# Altium project PERfECT-PRO.PrjPcb
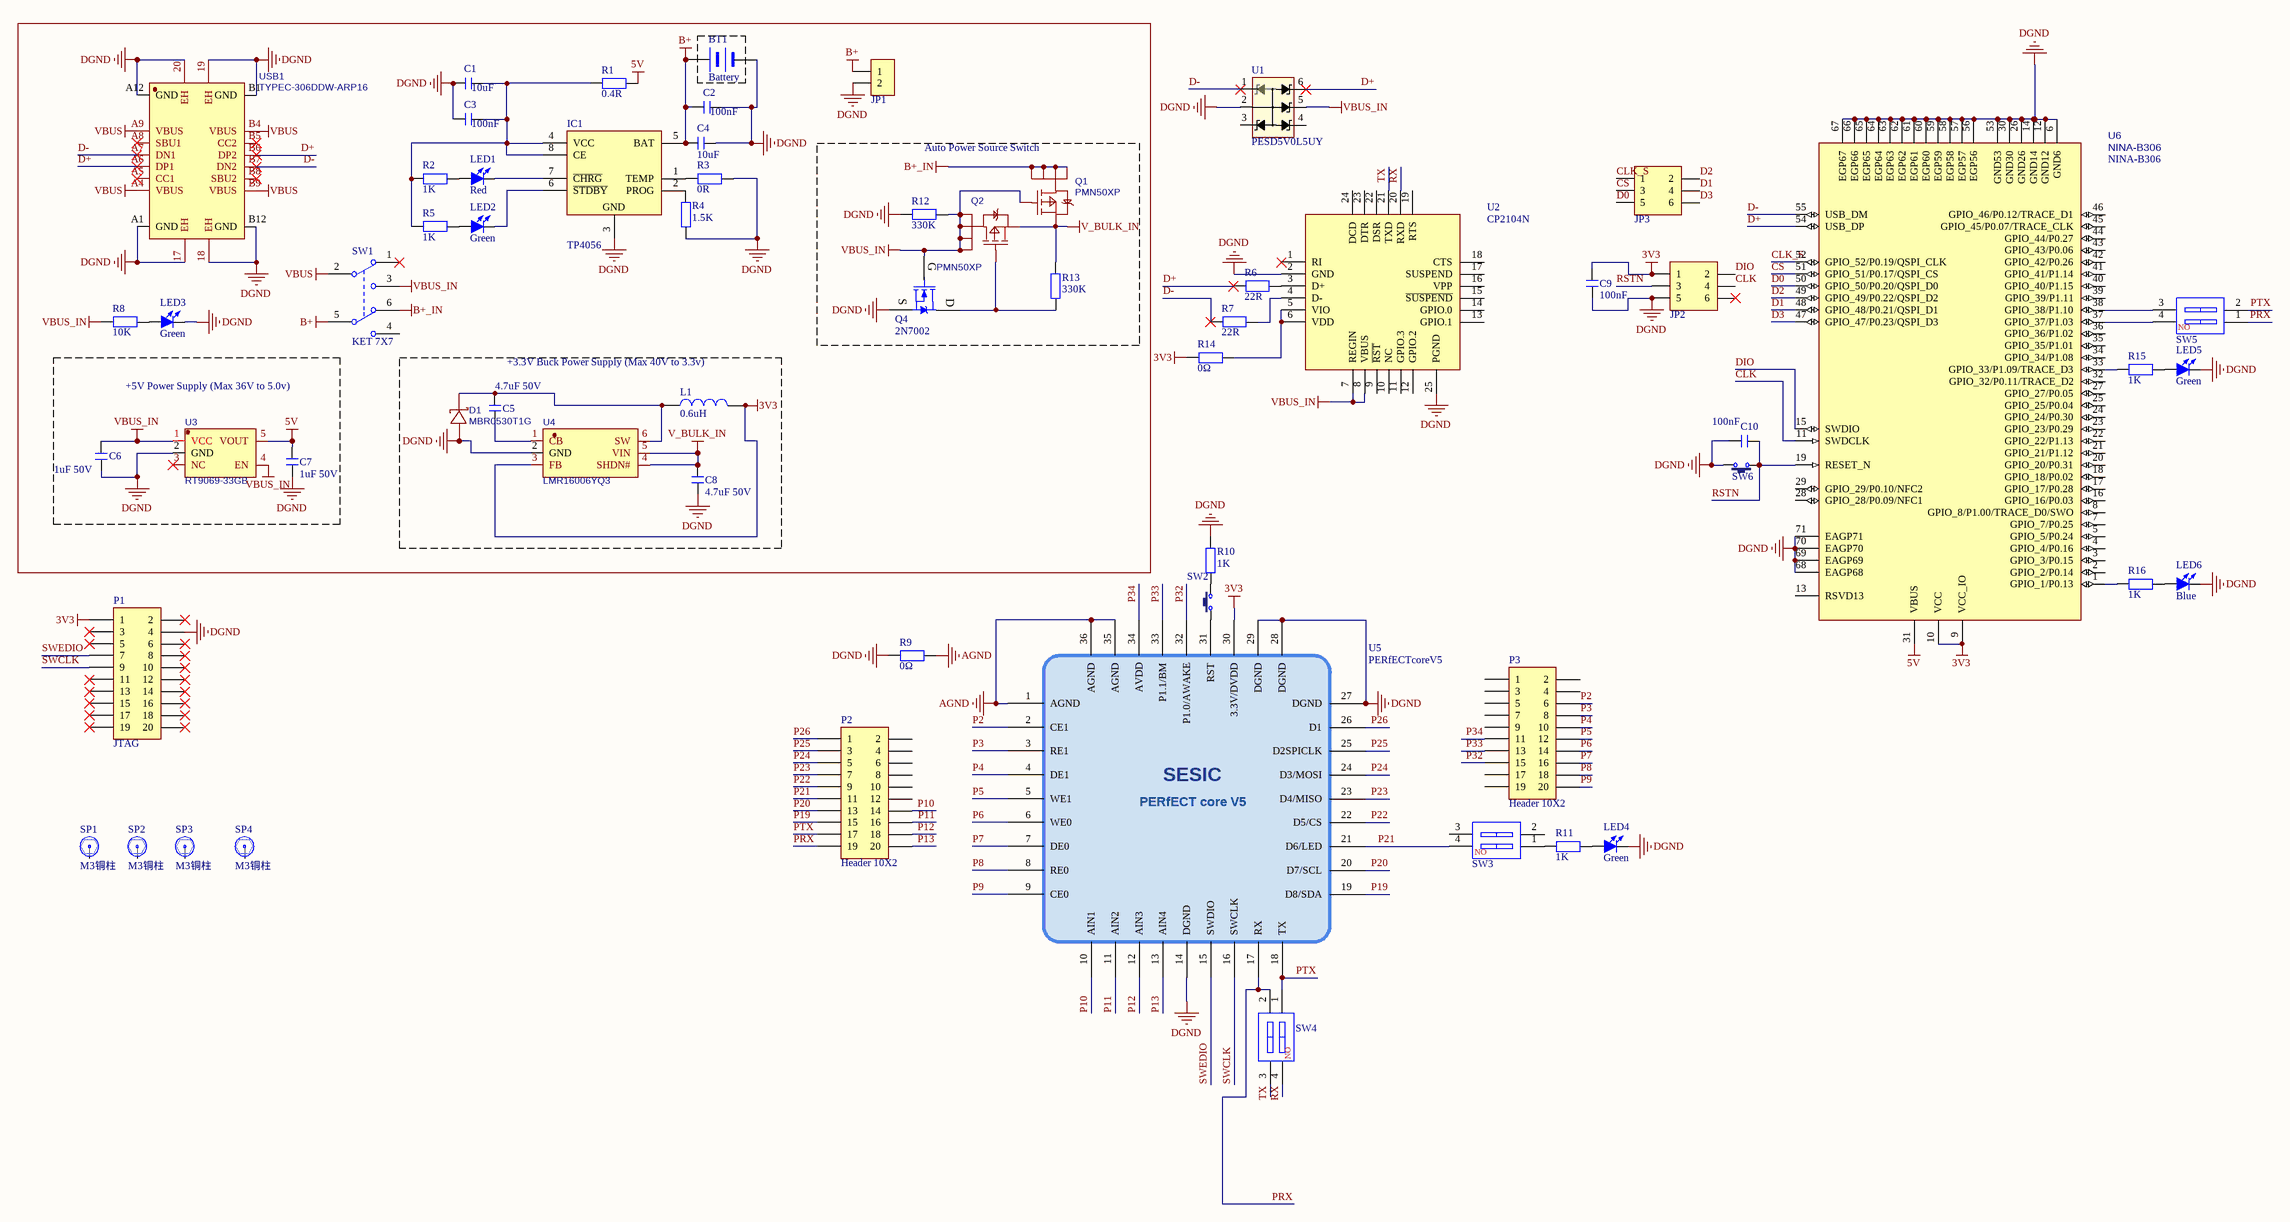
[diagram p0: PERfECT-PRO-1.SchDoc]
1 sheet, 62 parts. Net scope: global (net labels, ports and power ports of the same name join across sheets).
Board file: PERfECT-PRO.PcbDoc

## Sheet PERfECT-PRO-1.SchDoc
size A0

### Parts
BT1  Battery
C1  10uF  [C 0603_L]
C2  100nF  [C 0603_L]
C3  100nF  [C 0603_L]
C4  10uF  [C 0603_L]
C5  4.7uF 50V  [C 0603_L]
C6  1uF 50V  [C 0603_L]
C7  1uF 50V  [C 0603_L]
C8  4.7uF 50V  [C 0603_L]
C9  100nF  [C 0603_L]
C10  100nF  [C 0603_L]
D1  MBR0530T1G  [MBR0530T1G]
IC1  TP4056  [SOP8_N]
JP1  HDR-1X2  [XH2.54-LI-2P]  (value not drawn)
JP2  Header3X2  [HDR2.54-LI-2x3P]  (value not drawn)
JP3  Header3X2  [HDR2.54-LI-2x3P]  (value not drawn)
L1  0.6uH  [L 1206]
LED1  Red  [LED 0603R]
LED2  Green  [LED 0603R]
LED3  Green  [LED 0603R]
LED4  Green  [LED 0603R]
LED5  Green  [LED 0603R]
LED6  Blue  [LED 0603R]
P1  JTAG  [HDR2X10]
P2  Header 10X2  [HDR2X10]
P3  Header 10X2  [HDR2X10]
Q1  PMN50XP  [PMN50XP]
Q2  PMN50XP  [PMN50XP]
Q4  2N7002  [SOT23-3N]
R1  0.4R  [R 0603_L]
R2  1K  [R 0603_L]
R3  0R  [R 0603_L]
R4  1.5K  [R 0603_L]
R5  1K  [R 0603_L]
R6  22R  [R 0603_L]
R7  22R  [R 0603_L]
R8  10K  [R 0603_L]
R9  0Ω  [R 0603_L]
R10  1K  [R 0603_L]
R11  1K  [R 0603_L]
R12  330K  [R 0603_L]
R13  330K  [R 0603_L]
R14  0Ω  [R 0603_L]
R15  1K  [R 0603_L]
R16  1K  [R 0603_L]
SP1  M3铜柱  [M3x4_L]
SP2  M3铜柱  [M3x4_L]
SP3  M3铜柱  [M3x4_L]
SP4  M3铜柱  [M3x4_L]
SW1  KET 7X7  [KFT DIP-7X7]
SW2  3x6x5  [TSW SMD-3*6*2.5]  (value not drawn)
SW3  CSW-2P  [CSW1.27 SMD-2P]  (value not drawn)
SW4  CSW-2P  [CSW1.27 SMD-2P]  (value not drawn)
SW5  CSW-2P  [CSW1.27 SMD-2P]  (value not drawn)
SW6  3x6x5  [TSW SMD-3*6*2.5]  (value not drawn)
U1  PESD5V0L5UY  [SOT65P210X110-6N]
U2  CP2104N  [24-QFN]
U3  RT9069-33GB  [SOT-23-5_L3.0-W1.7-P0.95-LS2.8-BR]
U4  LMR16006YQ3  [LMR16006YQ3]
U5  PERfECTcoreV5  [PERfECTcore36]
U6  NINA-B306  [NINA_LGA71R_1500X1000X223_PCB]
USB1  TYPEC-306DDW-ARP16  [USBC_DIP]

### Blocks framed on the sheet
Auto Power Source Switch: Q1 Q2 Q4 R12 R13
+5V Power Supply (Max 36V to 5.0v): C6 C7 U3
+3.3V Buck Power Supply (Max 40V to 3.3v): C5 C8 D1 L1 U4

### Nets
3V3: C9.2 JP2.1 L1.2 P1.1 R14.1 U4.3(FB) U5.30(3.3V/DVDD) U6.9(VCC_IO) U6.10(VCC)
5V: C7.1 R1.2 U3.5(VOUT) U6.31(VBUS)
AGND: R9.2 U5.1(AGND) U5.35(AGND) U5.36(AGND)
B+: BT1.1(+) C2.1 C4.1 IC1.5(BAT) JP1.1 SW1.5(COM2)
B+_IN: Q1.1(D) Q1.2(D) Q1.5(D) Q1.6(D) SW1.6(NC2)
DGND: BT1.2(-) C1.1 C2.2 C3.1 C4.2 C6.1 C7.2 C8.2 C9.1 C10.1 D1.2(A) IC1.3(GND) JP1.2 JP2.5 LED3.2(K) LED4.2(K) LED5.2(K) LED6.2(K) P1.4 Q4.2(S) R3.2 R4.1 R9.1 R10.2 R12.1 SW6.2 U1.2 U2.2(GND) U2.25(PGND) U3.2(GND) U4.2(GND) U5.14(DGND) U5.27(DGND) U5.28(DGND) U5.29(DGND) U6.6(GND6) U6.12(GND12) U6.14(GND14) U6.26(GND26) U6.30(GND30) U6.53(GND53) U6.56(EGP56) U6.57(EGP57) U6.58(EGP58) U6.59(EGP59) U6.60(EGP60) U6.61(EGP61) U6.62(EGP62) U6.63(EGP63) U6.64(EGP64) U6.65(EGP65) U6.66(EGP66) U6.67(EGP67) U6.68(EAGP68) U6.69(EAGP69) U6.70(EAGP70) U6.71(EAGP71) USB1.17(EH) USB1.18(EH) USB1.19(EH) USB1.20(EH) USB1.A1(GND) USB1.A12(GND) USB1.B1(GND) USB1.B12(GND)
V_BULK_IN: C8.1 Q1.4(S) Q2.4(S) R13.2 U4.4(SHDN#) U4.5(VIN)
VBUS: SW1.2(COM2) USB1.A4(VBUS) USB1.A9(VBUS) USB1.B4(VBUS) USB1.B9(VBUS)
VBUS_IN: C6.2 Q1.3(G) Q2.1(D) Q2.2(D) Q2.5(D) Q2.6(D) Q4.1(G) R8.1 R12.2 SW1.3(NO1) U1.5 U2.7(REGIN) U2.8(VBUS) U3.1(VCC) U3.4(EN)
CLK: JP2.4 U6.11(SWDCLK)
CLK_S: JP3.1 U6.52(GPIO_52/P0.19/QSPI_CLK)
CS: JP3.3 U6.51(GPIO_51/P0.17/QSPI_CS)
D0: JP3.5 U6.50(GPIO_50/P0.20/QSPI_D0)
D1: JP3.4 U6.48(GPIO_48/P0.21/QSPI_D1)
D2: JP3.2 U6.49(GPIO_49/P0.22/QSPI_D2)
D3: JP3.6 U6.47(GPIO_47/P0.23/QSPI_D3)
D+: R6.1 U1.6 U6.54(USB_DP) USB1.A6(DP1) USB1.B6(DP2)
D-: R7.1 U1.1 U6.55(USB_DM) USB1.A7(DN1) USB1.B7(DN2)
DIO: JP2.2 U6.15(SWDIO)
P2: P3.6 U5.2(CE1)
P3: P3.8 U5.3(RE1)
P4: P3.10 U5.4(DE1)
P5: P3.12 U5.5(WE1)
P6: P3.14 U5.6(WE0)
P7: P3.16 U5.7(DE0)
P8: P3.18 U5.8(RE0)
P9: P3.20 U5.9(CE0)
P10: P2.14 U5.10(AIN1)
P11: P2.16 U5.11(AIN2)
P12: P2.18 U5.12(AIN3)
P13: P2.20 U5.13(AIN4)
P19: P2.15 U5.19(D8/SDA)
P20: P2.13 U5.20(D7/SCL)
P21: P2.11 SW3.4 U5.21(D6/LED)
P22: P2.9 U5.22(D5/CS)
P23: P2.7 U5.23(D4/MISO)
P24: P2.5 U5.24(D3/MOSI)
P25: P2.3 U5.25(D2SPICLK)
P26: P2.1 U5.26(D1)
P32: P3.15 U5.32(P1.0/AWAKE)
P33: P3.13 U5.33(P1.1/BM)
P34: P3.11 U5.34(AVDD)
PRX: P2.19 SW4.2 SW5.1 U5.17(RX)
PTX: P2.17 SW4.1 SW5.2 U5.18(TX)
RSTN: C10.2 JP2.3 SW6.1 U6.19(RESET_N)
RX: SW4.4 U2.20(RXD)
SWCLK: P1.9 U5.16(SWCLK)
SWEDIO: P1.7 U5.15(SWDIO)
TX: SW4.3 U2.21(TXD)
NetC1_2: C1.2 C3.2 IC1.4(VCC) IC1.8(CE) R1.1 R2.1 R5.1
NetC5_1: C5.1 D1.1(C) L1.1 U4.6(SW)
NetC5_2: C5.2 U4.1(CB)
NetIC1_1: IC1.1(TEMP) R3.1
NetIC1_2: IC1.2(PROG) R4.2
NetIC1_6: IC1.6(~{STDBY}) LED2.2(K)
NetIC1_7: IC1.7(~{CHRG}) LED1.2(K)
NetLED1_1: LED1.1(A) R2.2
NetLED2_1: LED2.1(A) R5.2
NetLED3_1: LED3.1(A) R8.2
NetLED4_1: LED4.1(A) R11.2
NetLED5_1: LED5.1(A) R15.2
NetLED6_1: LED6.1(A) R16.2
NetQ2_3: Q2.3(G) Q4.3(D) R13.1
NetR6_2: R6.2 U2.3(D+)
NetR7_2: R7.2 U2.4(D-)
NetR10_1: R10.1 SW2.2
NetR11_1: R11.1 SW3.1
NetR14_2: R14.2 U2.5(VIO) U2.6(VDD)
NetR15_1: R15.1 U6.33(GPIO_33/P1.09/TRACE_D3)
NetR16_1: R16.1 U6.1(GPIO_1/P0.13)
NetSW2_1: SW2.1 U5.31(RST)
NetSW5_3: SW5.3 U6.38(GPIO_38/P1.10)
NetSW5_4: SW5.4 U6.37(GPIO_37/P1.03)

Not connected (* = marked no-connect by the designer): JP2 6*; P1 2* 3* 5* 6* 8* 10* 11* 12* 13* 14* 15* 16* 17* 18* 19* 20*; P2 2 4 6 8 10 12; P3 1 2 3 4 5 7 9 17 19; SP1 1; SP2 1; SP3 1; SP4 1; SW1 1(NC1)* 4(NO2); SW3 2 3; U1 3 4; U2 1(RI)* 9(~{RST}) 10(NC) 11(GPIO.3) 12(GPIO.2) 13(GPIO.1) 14(GPIO.0) 15(~{SUSPEND}) 16(VPP) 17(SUSPEND) 18(CTS) 19(RTS) 22(DSR) 23(DTR) 24(DCD); U3 3(NC)*; U6 2(GPIO_2/P0.14) 3(GPIO_3/P0.15) 4(GPIO_4/P0.16) 5(GPIO_5/P0.24) 7(GPIO_7/P0.25) 8(GPIO_8/P1.00/TRACE_D0/SWO) 13(RSVD13) 16(GPIO_16/P0.03) 17(GPIO_17/P0.28) 18(GPIO_18/P0.02) 20(GPIO_20/P0.31) 21(GPIO_21/P1.12) 22(GPIO_22/P1.13) 23(GPIO_23/P0.29) 24(GPIO_24/P0.30) 25(GPIO_25/P0.04) 27(GPIO_27/P0.05) 28(GPIO_28/P0.09/NFC1) 29(GPIO_29/P0.10/NFC2) 32(GPIO_32/P0.11/TRACE_D2) 34(GPIO_34/P1.08) 35(GPIO_35/P1.01) 36(GPIO_36/P1.02) 39(GPIO_39/P1.11) 40(GPIO_40/P1.15) 41(GPIO_41/P1.14) 42(GPIO_42/P0.26) 43(GPIO_43/P0.06) 44(GPIO_44/P0.27) 45(GPIO_45/P0.07/TRACE_CLK) 46(GPIO_46/P0.12/TRACE_D1); USB1 A5(CC1)* A8(SBU1)* B5(CC2)* B8(SBU2)*

### Notes on the sheet
- (in symbol CSW-2P) NO
- (in symbol PERfECTcoreV5) SESIC; PERfECT core V5

### Library data of the parts
BT1 = 干电池
C1-C10 = C: 无极性贴片电容; 版权归属: 源创客; BOM名称: 无极性贴片电容; 学习资源: www.ooocke.com
D1 = MBR0530T1G: BOM_Manufacturer: ON; BOM_Supplier: LCSC; BOM_Manufacturer Part: MBR0530T1G; BOM_Supplier Part: C82046; BOM_JLCPCB Part Class: Extended Part; spicePre: D; spiceSymbolName: MBR0530T1G
IC1 = TP4056: 锂电池充电管理; 版权归属: 源创客; BOM名称: 锂电池充电管理; 学习资源: www.ooocke.com
JP1 = Header 2: 2P接插件; 版权归属: 源创客; BOM名称: 2P接插件; 学习资源: www.ooocke.com
JP2 JP3 = Header 3X2: 3*2P接插件; 版权归属: 源创客; BOM名称: 3*2P接插件; 学习资源: www.ooocke.com
L1 = L: 小功率贴片电感; 版权归属: 源创客; BOM名称: 小功率贴片电感; 学习资源: www.ooocke.com
LED1-LED6 = LED-SMD: 贴片LED; 版权归属: 源创客; BOM名称: 贴片LED; 学习资源: www.ooocke.com
P1-P3 = Header 10X2: Header, 10-Pin, Dual row; LatestRevisionDate: 17-Jul-2002; LatestRevisionNote: Re-released for DXP Platform.; Publisher: Altium Limited
Q1 Q2 = PMN50XP: BOM_Manufacturer: VBsemi Elec; Contributor: LCSC; BOM_Supplier: LCSC; BOM_Supplier Part: C558228; BOM_Manufacturer Part: PMN50XP; BOM_JLCPCB Part Class: Extended Part; spicePre: Q; spiceSymbolName: PMN50XP
Q4 = SI2302: N沟道场效应管; 版权归属: 源创客; BOM名称: N沟道场效应管; 学习资源: www.ooocke.com
R1-R16 = R: 贴片电阻; 版权归属: 源创客; BOM名称: 贴片电阻; 学习资源: www.ooocke.com
SP1-SP4 = 铜柱小焊盘: 铜柱; 版权归属: 源创客; BOM名称: 铜柱; 学习资源: www.ooocke.com
SW1 = KET 7X7: 7*7自锁开关; 版权归属: 源创客; BOM名称: 7*7自锁开关; 学习资源: www.ooocke.com
SW2 SW6 = TSW 3x6: 3x6轻触开关; 版权归属: 源创客; BOM名称: 3x6轻触开关; 学习资源: www.ooocke.com
SW3-SW5 = CSW-2P: 2路编码开关; 版权归属: 源创客; BOM名称: 2路编码开关; 学习资源: www.ooocke.com
U1 = PESD5V0L5UY: TVS SOT-363 RoHS; Manufacturer: Yenji; Vendor: LCSC; Value: ESD; PartNumber: PESD5V0L5UY
U2 = CP2104N: IC BRIDGE USB TO UART 24QFN; Manufacturer: Silicon Labs; PartNumber: C47742; Vendor: LCSC; Part_Footprint: 24QFN; Value: CP2104N
U3 = RT9069-33GB: BOM_Manufacturer: Richtek Tech; Contributor: LCSC; BOM_Supplier: LCSC; BOM_Supplier Part: C147969; BOM_Manufacturer Part: RT9069-33GB; BOM_JLCPCB Part Class: Extended Part; spicePre: U; spiceSymbolName: RT9069-33GB
U4 = LMR16006YQ3: BOM_Manufacturer: TI(Tex as Instruments); BOM_Manufacturer Part: LMR16006YDDCR; Contributor: LCSC; BOM_Supplier: LCSC; BOM_Supplier Part: C290195; BOM_JLCPCB Part Class: Extended Part; spicePre: U; spiceSymbolName: LMR16006YDDCR
U5 = PERfECTcoreV5: This is the 5th version of PERfEC core.https://github.com/WISE-PERfECT/PERfECT
U6 = NINA-B306: u-blox NINA-B306 Bluetooth 5 LE, 802.15.4 module; Part Description: Stand-alone Bluetooth low energy module; Manufacturer: u-blox; Value: NINA-B306
USB1 = TYPEC-306DDW-ARP16: BOM_Manufacturer: XUNPU(讯普); Contributor: LCSC; BOM_Supplier: LCSC; BOM_Supplier Part: C2840393; BOM_Manufacturer Part: TYPEC-306DDW-ARP16; spicePre: U; spiceSymbolName: TYPEC-306DDW-ARP16